# Altium schematic sheet RPS_ARMOR_light_PCB_2022_V1.0.SchDoc: RPS_ARMOR_light_PCB_2022
size A4; DrawnBy: SCQ; SheetNumber: 1; SheetTotal: 1; Version: 1.0
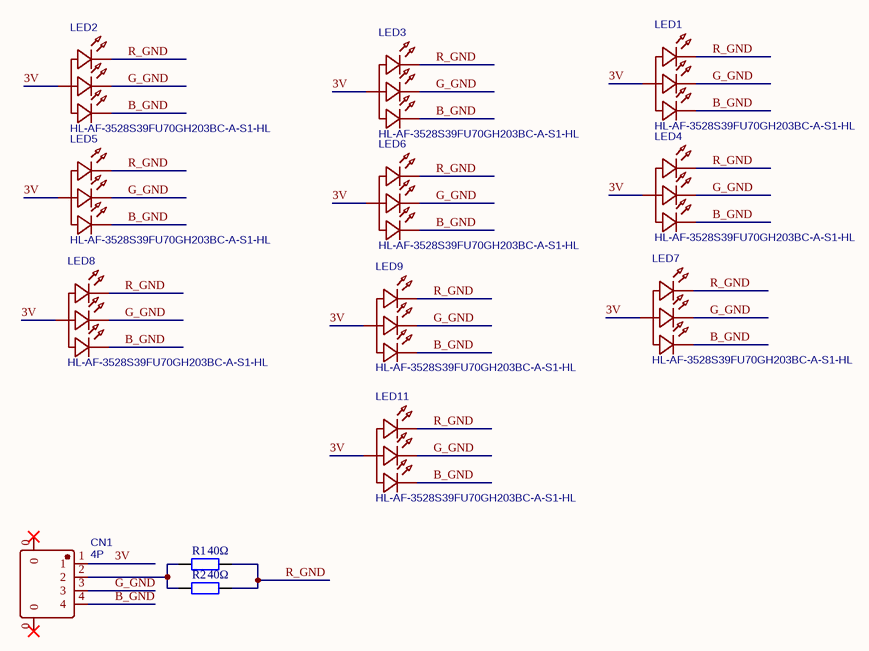
[diagram p0: RPS_ARMOR_light_PCB_2022_V1.0.SchDoc]

## Parts
CN1  4P  [GH1.25-WS-4P]
LED1  HL-AF-3528S39FU70GH203BC-A-S1-HL  [LED-SMD_4P-L3.2-W2.8-P1.70-TL]
LED2  HL-AF-3528S39FU70GH203BC-A-S1-HL  [LED-SMD_4P-L3.2-W2.8-P1.70-TL]
LED3  HL-AF-3528S39FU70GH203BC-A-S1-HL  [LED-SMD_4P-L3.2-W2.8-P1.70-TL]
LED4  HL-AF-3528S39FU70GH203BC-A-S1-HL  [LED-SMD_4P-L3.2-W2.8-P1.70-TL]
LED5  HL-AF-3528S39FU70GH203BC-A-S1-HL  [LED-SMD_4P-L3.2-W2.8-P1.70-TL]
LED6  HL-AF-3528S39FU70GH203BC-A-S1-HL  [LED-SMD_4P-L3.2-W2.8-P1.70-TL]
LED7  HL-AF-3528S39FU70GH203BC-A-S1-HL  [LED-SMD_4P-L3.2-W2.8-P1.70-TL]
LED8  HL-AF-3528S39FU70GH203BC-A-S1-HL  [LED-SMD_4P-L3.2-W2.8-P1.70-TL]
LED9  HL-AF-3528S39FU70GH203BC-A-S1-HL  [LED-SMD_4P-L3.2-W2.8-P1.70-TL]
LED11  HL-AF-3528S39FU70GH203BC-A-S1-HL  [LED-SMD_4P-L3.2-W2.8-P1.70-TL]
R1  40Ω  [LC-0805_R]
R2  40Ω  [LC-0805_R]

## Nets
3V: CN1.1 LED1.2(A) LED2.2(A) LED3.2(A) LED4.2(A) LED5.2(A) LED6.2(A) LED7.2(A) LED8.2(A) LED9.2(A) LED11.2(A)
B_GND: CN1.4 LED1.4(B) LED2.4(B) LED3.4(B) LED4.4(B) LED5.4(B) LED6.4(B) LED7.4(B) LED8.4(B) LED9.4(B) LED11.4(B)
G_GND: CN1.3 LED1.3(G) LED2.3(G) LED3.3(G) LED4.3(G) LED5.3(G) LED6.3(G) LED7.3(G) LED8.3(G) LED9.3(G) LED11.3(G)
R_GND: LED1.1(R) LED2.1(R) LED3.1(R) LED4.1(R) LED5.1(R) LED6.1(R) LED7.1(R) LED8.1(R) LED9.1(R) LED11.1(R) R1.2 R2.2
NetCN1_2: CN1.2 R1.1 R2.1

Not connected (* = marked no-connect by the designer): CN1 0*

## Notes on the sheet
- Title
- Size:
- Date:
- A4
- Version:
- Time:
- DrawnBy:
- Sheet
- of
- File:

## Library data of the parts
CN1 = 4P: BOM_Manufacturer: Changjiang Connectors; BOM_Manufacturer Part: A1257WR-S-4P; Contributor: LCSC; BOM_Supplier: LCSC; BOM_Supplier Part: C225127; BOM_JLCPCB Part Class: Extended Part; spicePre: C; spiceSymbolName: A1257WR-S-4P
LED1-LED9 LED11 = HL-AF-3528S39FU70GH203BC-A-S1-HL: BOM_Manufacturer: HONGLITRONIC(Hongli Zhihui (HONGLITRONIC)); Contributor: LCSC; BOM_Supplier: LCSC; BOM_Supplier Part: C516144; BOM_Manufacturer Part: HL-AF-3528S39FU70GH203BC-A-S1-HL; spicePre: L; spiceSymbolName: HL-AF-3528S39FU70GH203BC-A-S1-HL
R1 R2 = 0603 100KΩ (1003) 1%: 贴片电阻; ComponentLink1Description: 供应商链接; ComponentLink1URL: http://www.szlcsc.com/product/details_26546.html; Package: 0603; Supplier: LC; SuppliersPartNumber: C25803